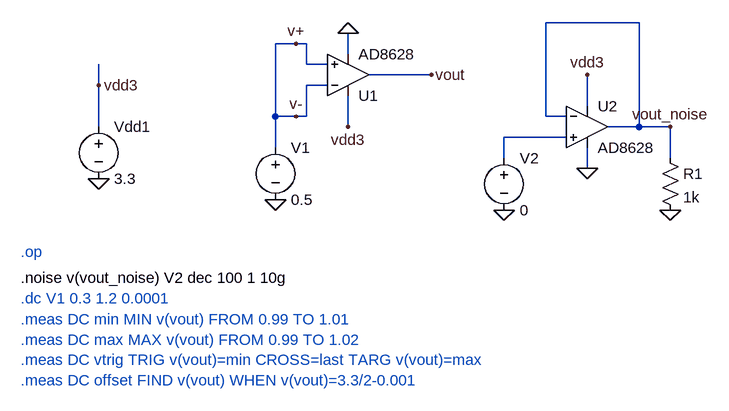
[diagram p0: schematic AD8628_char.asc]
AD8628_char.asc, the LTspice schematic file:
Version 4.1
SHEET 1 1252 680
WIRE 896 0 752 0
WIRE 368 32 336 32
WIRE 384 32 368 32
WIRE 448 48 448 16
WIRE 384 64 384 32
WIRE 416 64 384 64
WIRE 576 80 480 80
WIRE 64 96 64 64
WIRE 416 96 384 96
WIRE 816 128 816 80
WIRE 336 144 336 32
WIRE 368 144 336 144
WIRE 384 144 384 96
WIRE 384 144 368 144
WIRE 752 144 752 0
WIRE 784 144 752 144
WIRE 64 160 64 96
WIRE 448 160 448 112
WIRE 896 160 896 0
WIRE 896 160 848 160
WIRE 944 160 896 160
WIRE 784 176 688 176
WIRE 336 192 336 144
WIRE 688 208 688 176
WIRE 944 208 944 160
WIRE 816 224 816 192
FLAG 448 160 vdd3
FLAG 448 16 0
FLAG 64 240 0
FLAG 64 96 vdd3
FLAG 576 80 vout
FLAG 368 32 v+
FLAG 368 144 v-
FLAG 336 272 0
FLAG 816 80 vdd3
FLAG 816 224 0
FLAG 944 160 vout_noise
FLAG 688 288 0
FLAG 944 288 0
SYMBOL OpAmps\\AD8628 448 144 M180
SYMATTR InstName U1
SYMBOL voltage 64 144 R0
SYMATTR InstName Vdd1
SYMATTR Value 3.3
SYMBOL voltage 336 176 R0
WINDOW 123 0 0 Left 0
WINDOW 39 0 0 Left 0
SYMATTR InstName V1
SYMATTR Value 0.5
SYMBOL OpAmps\\AD8628 816 96 R0
SYMATTR InstName U2
SYMBOL voltage 688 192 R0
WINDOW 123 0 0 Left 0
WINDOW 39 0 0 Left 0
SYMATTR InstName V2
SYMATTR Value 0
SYMBOL res 928 192 R0
SYMATTR InstName R1
SYMATTR Value 1k
TEXT -56 352 Left 2 ;.op
TEXT -56 424 Left 2 ;.dc V1 0.3 1.2 0.0001
TEXT -56 456 Left 2 ;.meas DC min MIN v(vout) FROM 0.99 TO 1.01\n.meas DC max MAX v(vout) FROM 0.99 TO 1.02\n.meas DC vtrig TRIG v(vout)=min CROSS=last TARG v(vout)=max\n.meas DC offset FIND v(vout) WHEN v(vout)=3.3/2-0.001
TEXT -56 392 Left 2 !.noise v(vout_noise) V2 dec 100 1 10g

The netlist it stands for:
* AD8628_char.asc
X§U1 v- v- vdd3 0 vout AD8628  ; pins In+ In- V+ V- OUT
Vdd1 vdd3 0 3.3
V1 v- 0 0.5
X§U2 N001 vout_noise vdd3 0 vout_noise AD8628  ; pins In+ In- V+ V- OUT
V2 N001 0 0
R1 vout_noise 0 1k
* .op
* .dc V1 0.3 1.2 0.0001
* .meas DC min MIN v(vout) FROM 0.99 TO 1.01
* .meas DC max MAX v(vout) FROM 0.99 TO 1.02
* .meas DC vtrig TRIG v(vout)=min CROSS=last TARG v(vout)=max
* .meas DC offset FIND v(vout) WHEN v(vout)=3.3/2-0.001
.noise v(vout_noise) V2 dec 100 1 10g
.backanno
.end